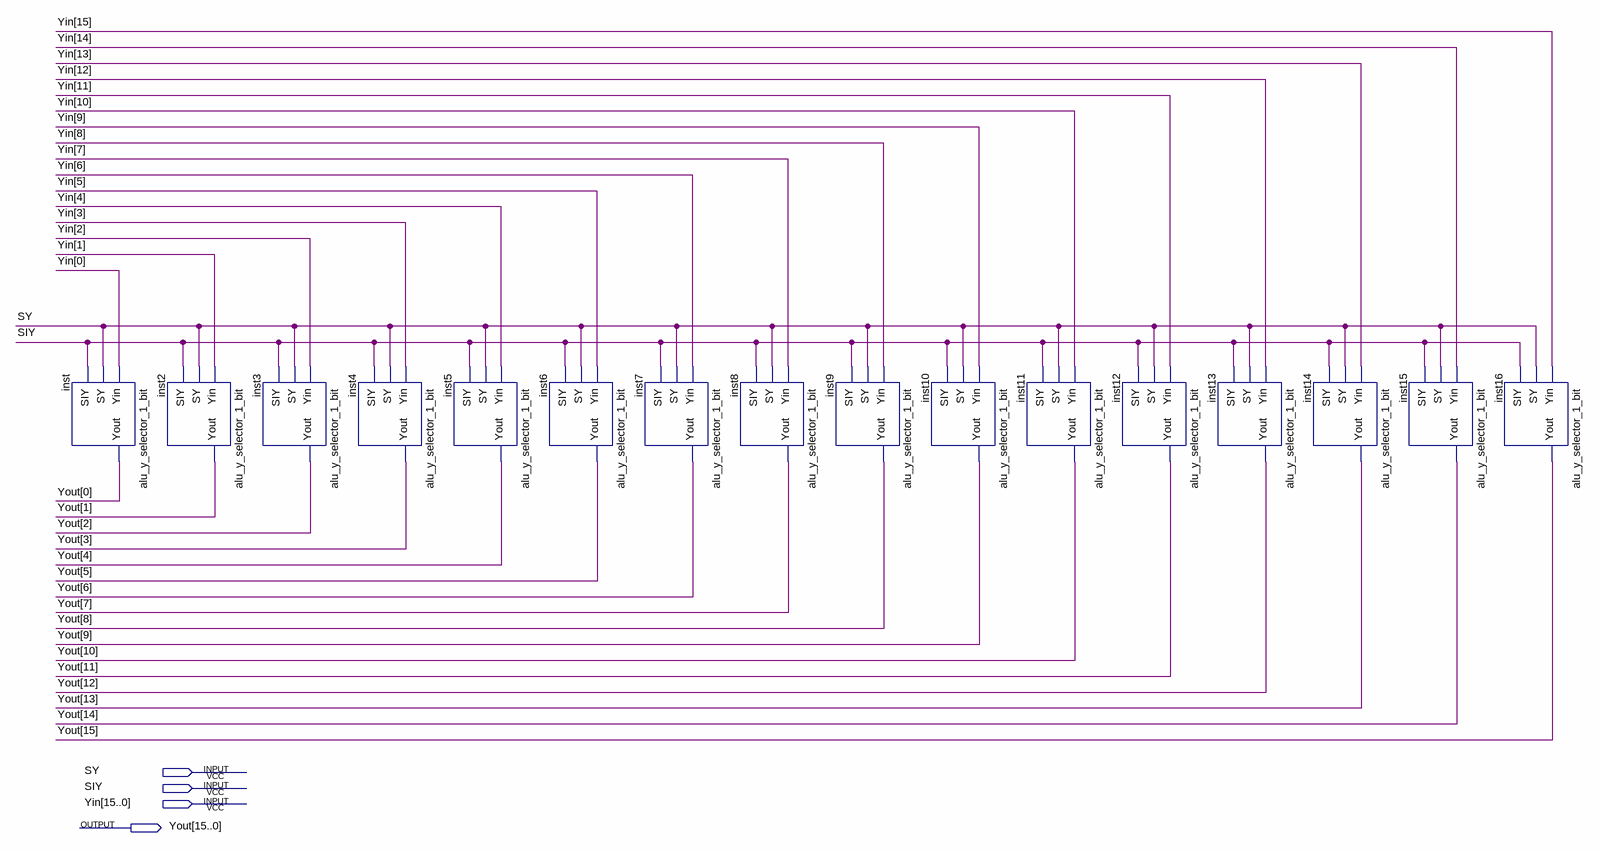
[diagram p0: schematic sheet]
// Quartus schematic alu_y_selector.bdf as structural Verilog: 16 symbols, 4 pins
module alu_y_selector (
  input  SY,
  input  SIY,
  input  [15:0] Yin,
  output [15:0] Yout
);

  alu_y_selector_1_bit inst (.Yin(Yin[0]), .SY(SY), .SIY(SIY), .Yout(Yout[0]));
  alu_y_selector_1_bit inst2 (.Yin(Yin[1]), .SY(SY), .SIY(SIY), .Yout(Yout[1]));
  alu_y_selector_1_bit inst3 (.Yin(Yin[2]), .SY(SY), .SIY(SIY), .Yout(Yout[2]));
  alu_y_selector_1_bit inst4 (.Yin(Yin[3]), .SY(SY), .SIY(SIY), .Yout(Yout[3]));
  alu_y_selector_1_bit inst5 (.Yin(Yin[4]), .SY(SY), .SIY(SIY), .Yout(Yout[4]));
  alu_y_selector_1_bit inst6 (.Yin(Yin[5]), .SY(SY), .SIY(SIY), .Yout(Yout[5]));
  alu_y_selector_1_bit inst7 (.Yin(Yin[6]), .SY(SY), .SIY(SIY), .Yout(Yout[6]));
  alu_y_selector_1_bit inst8 (.Yin(Yin[7]), .SY(SY), .SIY(SIY), .Yout(Yout[7]));
  alu_y_selector_1_bit inst9 (.Yin(Yin[8]), .SY(SY), .SIY(SIY), .Yout(Yout[8]));
  alu_y_selector_1_bit inst10 (.Yin(Yin[9]), .SY(SY), .SIY(SIY), .Yout(Yout[9]));
  alu_y_selector_1_bit inst11 (.Yin(Yin[10]), .SY(SY), .SIY(SIY), .Yout(Yout[10]));
  alu_y_selector_1_bit inst12 (.Yin(Yin[11]), .SY(SY), .SIY(SIY), .Yout(Yout[11]));
  alu_y_selector_1_bit inst13 (.Yin(Yin[12]), .SY(SY), .SIY(SIY), .Yout(Yout[12]));
  alu_y_selector_1_bit inst14 (.Yin(Yin[13]), .SY(SY), .SIY(SIY), .Yout(Yout[13]));
  alu_y_selector_1_bit inst15 (.Yin(Yin[14]), .SY(SY), .SIY(SIY), .Yout(Yout[14]));
  alu_y_selector_1_bit inst16 (.Yin(Yin[15]), .SY(SY), .SIY(SIY), .Yout(Yout[15]));
endmodule
